# Altium schematic sheet Buck.SchDoc
size A4
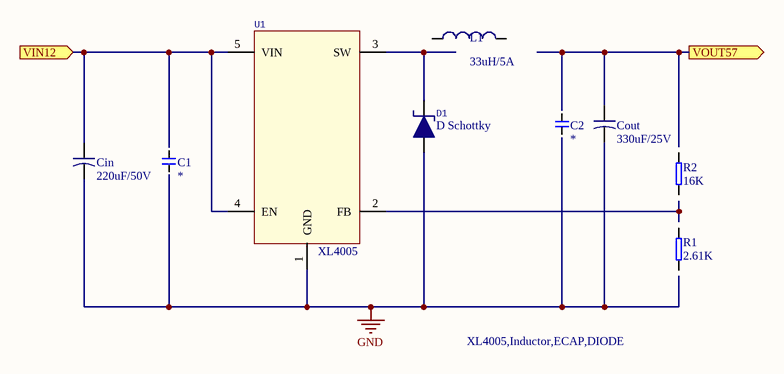
[diagram p0: Buck.SchDoc]

## Parts
C1  *  [CAP 0603/1608]
C2  *  [CAP 0603/1608]
Cin  220uF/50V
Cout  330uF/25V
D1  D Schottky
L1  value 33uH/5A  [INDUCTOR PCC-M0530M3R3KVP]  (hidden comment: Inductor)
R1  2.61K  [RES 0603/1608]
R2  16K  [RES 0603/1608]
U1  XL4005

## Ports
VIN12, VOUT57 (out)

## Nets
GND: Cin.2 Cout.2 D1.2 U1.1(GND)
VIN12: Cin.1 U1.4(EN) U1.5(VIN) ; port VIN12
VOUT57: Cout.1 ; port VOUT57
NetD1_1: D1.1 U1.3(SW)

Not connected (* = marked no-connect by the designer): C1 1 2; C2 1 2; L1 1 2; R1 1 2; R2 1 2; U1 2(FB)

## Notes on the sheet
- XL4005,Inductor,ECAP,DIODE

## Library data of the parts
C1 C2 = CAP: Capacitor; Note: *; Desc: *; Value: *
Cin Cout = E CAP
  Cin: Value: 220uF/50V
  Cout: Value: 330uF/25V
L1 = Inductor: Code_IEC: 1005; Published: 8-Jun-2000; LatestRevisionDate: 29-May-2009; LatestRevisionNote: IPC-7351 Footprint Added.; PackageReference: 0402-A; Publisher: Altium Limited; PackageDescription: Chip Inductor; Code_JEITA: 0402
R1 R2 = RES: Resistor; Note: *; Desc: *
  R1: Value: 2.61K
  R2: Value: 16K
U1 = XL4005: Buck Regulator